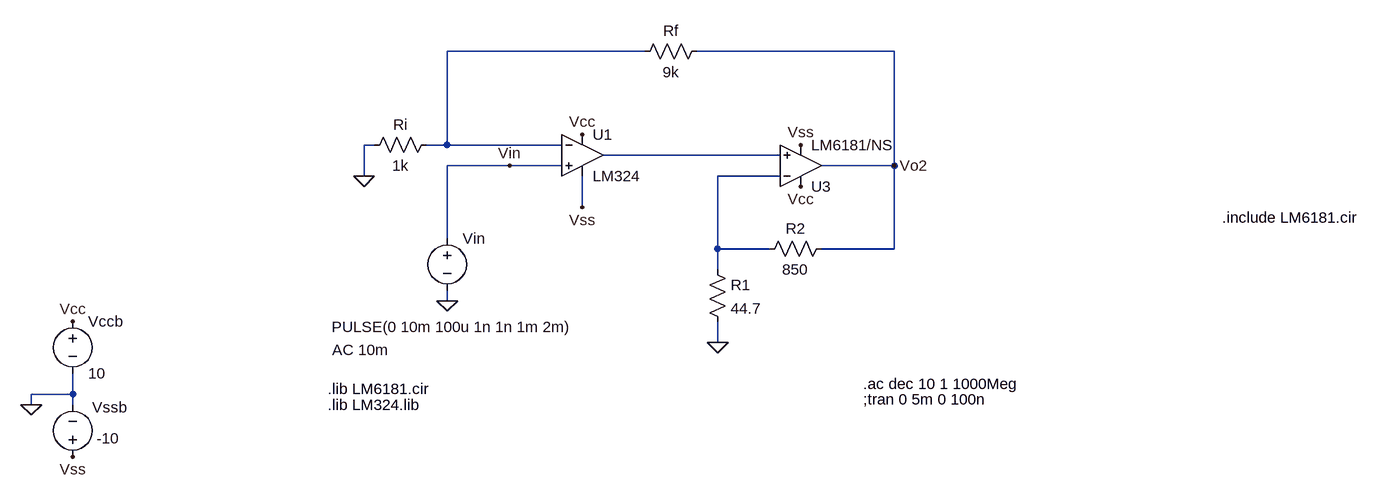
[diagram p0: schematic Lab3_Compensacion(VFA-CFA) (1).asc]
Lab3_Compensacion(VFA-CFA) (1).asc, the LTspice schematic file:
Version 4
SHEET 1 1340 720
WIRE 224 -16 -80 -16
WIRE 608 -16 304 -16
WIRE -192 128 -208 128
WIRE -80 128 -80 -16
WIRE -80 128 -112 128
WIRE 96 128 -80 128
WIRE 432 144 160 144
WIRE 16 160 -80 160
WIRE 96 160 16 160
WIRE 608 160 608 -16
WIRE 608 160 496 160
WIRE -208 176 -208 128
WIRE 432 176 336 176
WIRE 128 224 128 176
WIRE -80 272 -80 160
WIRE 336 288 336 176
WIRE 416 288 336 288
WIRE 608 288 608 160
WIRE 608 288 496 288
WIRE 336 320 336 288
WIRE -80 368 -80 352
WIRE 336 432 336 400
WIRE -656 512 -656 480
WIRE -656 512 -720 512
WIRE -720 528 -720 512
WIRE -656 528 -656 512
FLAG 128 224 Vss
FLAG 128 112 Vcc
FLAG -80 368 0
FLAG -720 528 0
FLAG -656 400 Vcc
FLAG -656 608 Vss
FLAG -208 176 0
FLAG 336 432 0
FLAG 464 192 Vcc
FLAG 464 128 Vss
FLAG 608 160 Vo2
FLAG 16 160 Vin
SYMBOL OpAmps\\opamp2 128 80 R0
SYMATTR InstName U1
SYMATTR Value LM324
SYMBOL voltage -80 256 R0
WINDOW 123 -177 188 Left 2
WINDOW 39 0 0 Left 0
WINDOW 3 -178 152 Left 2
SYMATTR Value2 AC 10m
SYMATTR Value PULSE(0 10m 100u 1n 1n 1m 2m)
SYMATTR InstName Vin
SYMBOL voltage -656 384 R0
WINDOW 123 0 0 Left 0
WINDOW 39 0 0 Left 0
SYMATTR InstName Vccb
SYMATTR Value 10
SYMBOL voltage -656 624 R180
WINDOW 123 0 0 Left 0
WINDOW 39 0 0 Left 0
WINDOW 0 -83 92 Left 2
WINDOW 3 -72 44 Left 2
SYMATTR InstName Vssb
SYMATTR Value -10
SYMBOL res 320 304 R0
SYMATTR InstName R1
SYMATTR Value 44.7
SYMBOL res 512 272 R90
WINDOW 0 0 56 VBottom 2
WINDOW 3 32 56 VTop 2
SYMATTR InstName R2
SYMATTR Value 850
SYMBOL res 320 -32 R90
WINDOW 0 0 56 VBottom 2
WINDOW 3 32 56 VTop 2
SYMATTR InstName Rf
SYMATTR Value 9k
SYMBOL res -96 112 R90
WINDOW 0 0 56 VBottom 2
WINDOW 3 32 56 VTop 2
SYMATTR InstName Ri
SYMATTR Value 1k
SYMBOL OpAmps\\opamp2 464 224 M180
SYMATTR InstName U3
SYMATTR Value LM6181/NS
TEXT -264 528 Left 2 !.lib LM324.lib
TEXT 560 496 Left 2 !.ac dec 10 1 1000Meg
TEXT 560 520 Left 2 !;tran 0 5m 0 100n
TEXT -264 504 Left 2 !.lib LM6181.cir
TEXT 1112 240 Left 2 !.include LM6181.cir

The netlist it stands for:
* Lab3_Compensacion(VFA-CFA) (1).asc
XU1 Vin N001 Vcc Vss N002 LM324  ; pins In+ In- V+ V- OUT
Vin Vin 0 PULSE(0 10m 100u 1n 1n 1m 2m) AC 10m
Vccb Vcc 0 10
Vssb Vss 0 -10
R1 N003 0 44.7
R2 Vo2 N003 850
Rf Vo2 N001 9k
Ri N001 0 1k
XU3 N002 N003 Vcc Vss Vo2 LM6181/NS  ; pins In+ In- V+ V- OUT
.lib LM324.lib
.ac dec 10 1 1000Meg
;tran 0 5m 0 100n
.lib LM6181.cir
.include LM6181.cir
.backanno
.end